# Altium schematic sheet C51_led.SchDoc
size A3
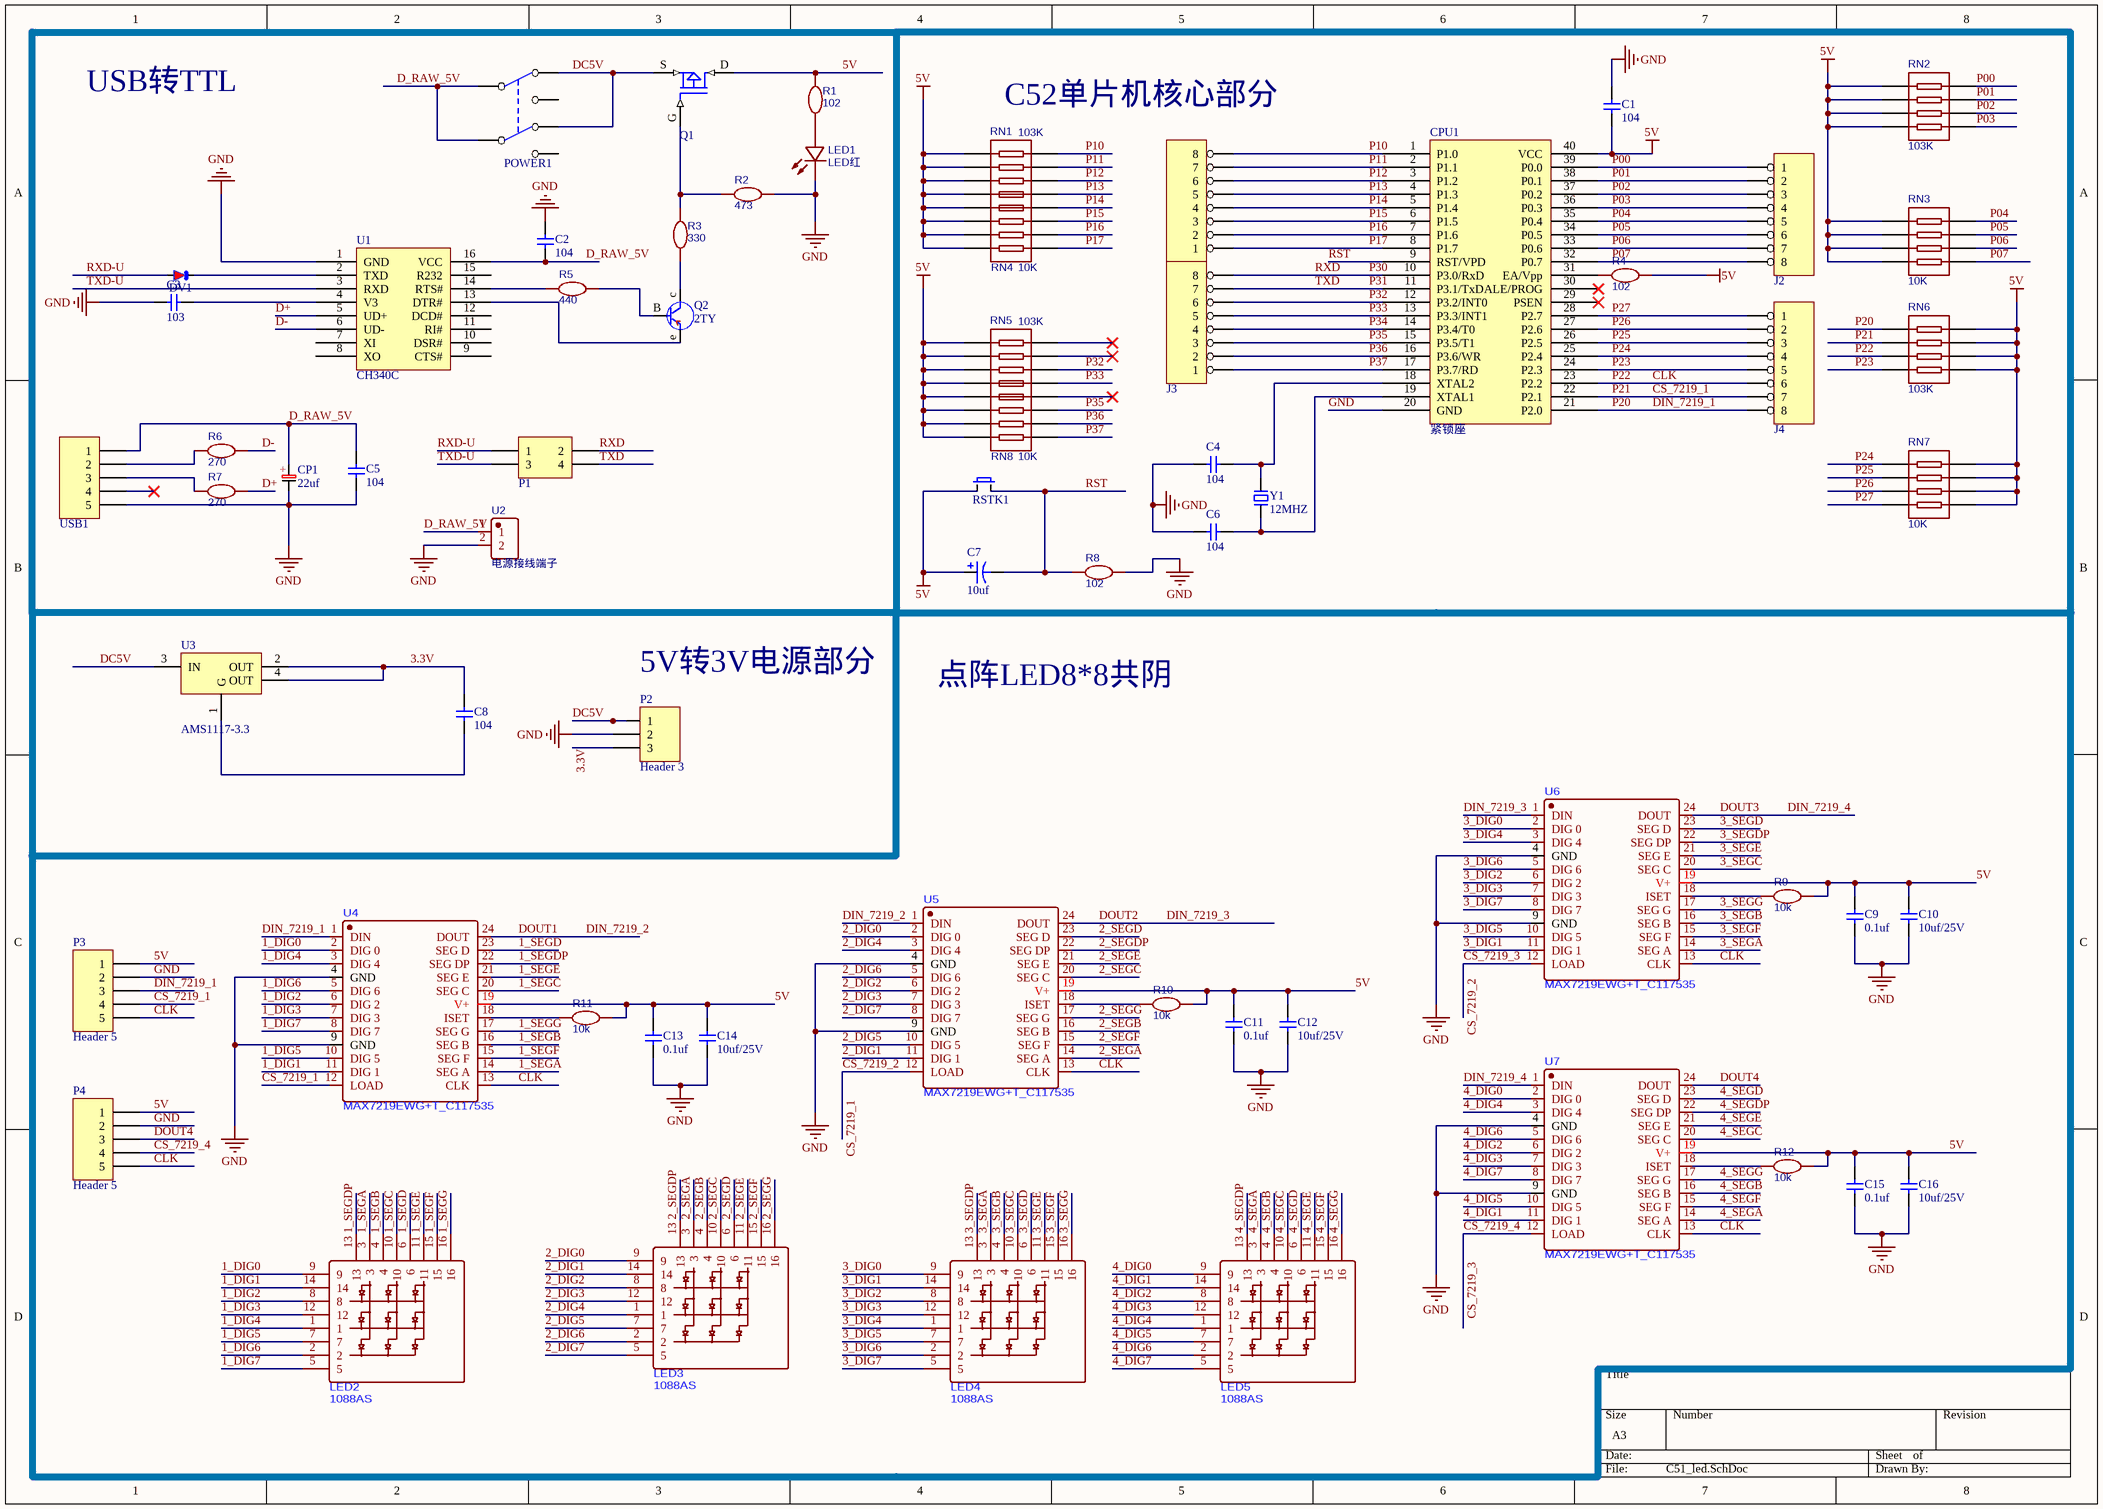
[diagram p0: C51_led.SchDoc]

## Parts
C1  104  [C1206]
C2  104  [C1206]
C3  103  [C1206]
C4  104  [C1206]
C5  104  [C1206]
C6  104  [C1206]
C7  10uf  [CD4]
C8  104  [C1206]
C9  0.1uf  [C1206]
C10  10uf/25V  [C1206]
C11  0.1uf  [C1206]
C12  10uf/25V  [C1206]
C13  0.1uf  [C1206]
C14  10uf/25V  [C1206]
C15  0.1uf  [C1206]
C16  10uf/25V  [C1206]
CP1  22uf  [CD4]
CPU1  紧锁座  [ZIF40 - D]
DV1  IN4148  [D1808A]  (value not drawn)
J1  SIP8  [SIP8]  (value not drawn)
J2  SIP8  [SIP8]  (value not drawn)
J3  SIP8  [SIP8]  (value not drawn)
J4  SIP8  [SIP8]  (value not drawn)
LED1  LED红  [LED1206-R-RD]
LED2  1088AS  [1088AS]
LED3  1088AS  [1088AS]
LED4  1088AS  [1088AS]
LED5  1088AS  [1088AS]
P1  Header 2X2  [HDR2X2]  (value not drawn)
P2  Header 3  [HDR1X3]
P3  Header 5  [HDR1X5]
P4  Header 5  [HDR1X5]
POWER1  自锁开关  [SW6]  (value not drawn)
Q1  MOS-P  [MOS-P]  (value not drawn)
Q2  2TY  [NPN-2TY]
R1  102  [R1206]
R2  473  [R1206]
R3  330  [R1206]
R4  102  [R1206]
R5  440  [R1206]
R6  270  [R1206]
R7  270  [R1206]
R8  102  [R1206]
R9  10k  [R1206]
R10  10k  [R1206]
R11  10k  [R1206]
R12  10k  [R1206]
RN1  103K  [RES-ARRAY-SMD_0603-8P-L3.2-W1.6-BL]
RN2  103K  [RES-ARRAY-SMD_0603-8P-L3.2-W1.6-BL]
RN3  10K  [RES-ARRAY-SMD_0603-8P-L3.2-W1.6-BL]
RN4  10K  [RES-ARRAY-SMD_0603-8P-L3.2-W1.6-BL]
RN5  103K  [RES-ARRAY-SMD_0603-8P-L3.2-W1.6-BL]
RN6  103K  [RES-ARRAY-SMD_0603-8P-L3.2-W1.6-BL]
RN7  10K  [RES-ARRAY-SMD_0603-8P-L3.2-W1.6-BL]
RN8  10K  [RES-ARRAY-SMD_0603-8P-L3.2-W1.6-BL]
RSTK1  按键  [JZ-SW2]  (value not drawn)
U1  CH340C  [SOP-16]
U2  电源接线端子  [2p_power]
U3  AMS1117-3.3  [SOT261]
U4  MAX7219EWG+T_C117535  [sop-24]
U5  MAX7219EWG+T_C117535  [sop-24]
U6  MAX7219EWG+T_C117535  [sop-24]
U7  MAX7219EWG+T_C117535  [sop-24]
USB1  MiniUSB  [MINIUSB_5PIN_4Pad_New]  (value not drawn)
Y1  12MHZ  [CC0.254]

## Blocks framed on the sheet
USB转TTL: C2 C3 C5 CP1 DV1 LED1 P1 POWER1 Q1 Q2 R1-R3 R5-R7 U1 U2 USB1

## Nets
5V: C1.1 C7.1 C9.2 C10.2 C11.2 C12.2 C13.2 C14.2 C15.2 C16.2 CPU1.40(VCC) P3.1 P4.1 Q1.D R1.1 R4.2 R9.1 R10.1 R11.1 R12.1 RN1.1 RN1.2 RN1.3 RN1.4 RN2.5 RN2.6 RN2.7 RN2.8 RN3.5 RN3.6 RN3.7 RN3.8 RN4.1 RN4.2 RN4.3 RN4.4 RN5.1 RN5.2 RN5.3 RN5.4 RN6.1 RN6.2 RN6.3 RN6.4 RN7.1 RN7.2 RN7.3 RN7.4 RN8.1 RN8.2 RN8.3 RN8.4 RSTK1.1 U4.19(V+) U5.19(V+) U6.19(V+) U7.19(V+)
GND: C1.2 C2.1 C3.1 C4.2 C5.1 C6.2 C9.1 C10.1 C11.1 C12.1 C13.1 C14.1 C15.1 C16.1 CP1.2 CPU1.20(GND) LED1.2(K) P2.2 P3.2 P4.2 R2.2 R8.2 U1.1(GND) U2.2 U4.4(GND) U4.9(GND) U5.4(GND) U5.9(GND) U6.4(GND) U6.9(GND) U7.4(GND) U7.9(GND) USB1.5
1_DIG0: LED2.9 U4.2(DIG_0)
1_DIG1: LED2.14 U4.11(DIG_1)
1_DIG2: LED2.8 U4.6(DIG_2)
1_DIG3: LED2.12 U4.7(DIG_3)
1_DIG4: LED2.1 U4.3(DIG_4)
1_DIG5: LED2.7 U4.10(DIG_5)
1_DIG6: LED2.2 U4.5(DIG_6)
1_DIG7: LED2.5 U4.8(DIG_7)
1_SEGA: LED2.3 U4.14(SEG_A)
1_SEGB: LED2.4 U4.16(SEG_B)
1_SEGC: LED2.10 U4.20(SEG_C)
1_SEGD: LED2.6 U4.23(SEG_D)
1_SEGDP: LED2.13 U4.22(SEG_DP)
1_SEGE: LED2.11 U4.21(SEG_E)
1_SEGF: LED2.15 U4.15(SEG_F)
1_SEGG: LED2.16 U4.17(SEG_G)
2_DIG0: LED3.9 U5.2(DIG_0)
2_DIG1: LED3.14 U5.11(DIG_1)
2_DIG2: LED3.8 U5.6(DIG_2)
2_DIG3: LED3.12 U5.7(DIG_3)
2_DIG4: LED3.1 U5.3(DIG_4)
2_DIG5: LED3.7 U5.10(DIG_5)
2_DIG6: LED3.2 U5.5(DIG_6)
2_DIG7: LED3.5 U5.8(DIG_7)
2_SEGA: LED3.3 U5.14(SEG_A)
2_SEGB: LED3.4 U5.16(SEG_B)
2_SEGC: LED3.10 U5.20(SEG_C)
2_SEGD: LED3.6 U5.23(SEG_D)
2_SEGDP: LED3.13 U5.22(SEG_DP)
2_SEGE: LED3.11 U5.21(SEG_E)
2_SEGF: LED3.15 U5.15(SEG_F)
2_SEGG: LED3.16 U5.17(SEG_G)
3.3V: C8.2 P2.3 U3.2(OUT) U3.4(OUT)
3_DIG0: LED4.9 U6.2(DIG_0)
3_DIG1: LED4.14 U6.11(DIG_1)
3_DIG2: LED4.8 U6.6(DIG_2)
3_DIG3: LED4.12 U6.7(DIG_3)
3_DIG4: LED4.1 U6.3(DIG_4)
3_DIG5: LED4.7 U6.10(DIG_5)
3_DIG6: LED4.2 U6.5(DIG_6)
3_DIG7: LED4.5 U6.8(DIG_7)
3_SEGA: LED4.3 U6.14(SEG_A)
3_SEGB: LED4.4 U6.16(SEG_B)
3_SEGC: LED4.10 U6.20(SEG_C)
3_SEGD: LED4.6 U6.23(SEG_D)
3_SEGDP: LED4.13 U6.22(SEG_DP)
3_SEGE: LED4.11 U6.21(SEG_E)
3_SEGF: LED4.15 U6.15(SEG_F)
3_SEGG: LED4.16 U6.17(SEG_G)
4_DIG0: LED5.9 U7.2(DIG_0)
4_DIG1: LED5.14 U7.11(DIG_1)
4_DIG2: LED5.8 U7.6(DIG_2)
4_DIG3: LED5.12 U7.7(DIG_3)
4_DIG4: LED5.1 U7.3(DIG_4)
4_DIG5: LED5.7 U7.10(DIG_5)
4_DIG6: LED5.2 U7.5(DIG_6)
4_DIG7: LED5.5 U7.8(DIG_7)
4_SEGA: LED5.3 U7.14(SEG_A)
4_SEGB: LED5.4 U7.16(SEG_B)
4_SEGC: LED5.10 U7.20(SEG_C)
4_SEGD: LED5.6 U7.23(SEG_D)
4_SEGDP: LED5.13 U7.22(SEG_DP)
4_SEGE: LED5.11 U7.21(SEG_E)
4_SEGF: LED5.15 U7.15(SEG_F)
4_SEGG: LED5.16 U7.17(SEG_G)
CLK: CPU1.23(P2.2) J4.6 P3.5 P4.5 RN6.6 U4.13(CLK) U5.13(CLK) U6.13(CLK) U7.13(CLK)  [also labelled P22]
CS_7219_1: CPU1.22(P2.1) J4.7 P3.4 P4.4 RN6.7 U4.12(LOAD) U5.12(LOAD) U6.12(LOAD) U7.12(LOAD)  [also labelled CS_7219_2, CS_7219_3, CS_7219_4, P21]
D+: R7.2 U1.5(UD+)
D-: R6.2 U1.6(UD-)
D_RAW_5V: C2.2 C5.2 CP1.1 POWER1.2(COMMON1) POWER1.5(COMMON2) U1.16(VCC) U2.1 USB1.1
DC5V: P2.1 POWER1.1(NC1) POWER1.6(NC2) Q1.S U3.3(IN)
DIN_7219_1: CPU1.21(P2.0) J4.8 P3.3 RN6.8 U4.1(DIN)  [also labelled P20]
DIN_7219_2: U4.24(DOUT) U5.1(DIN)  [also labelled DOUT1]
DIN_7219_3: U5.24(DOUT) U6.1(DIN)  [also labelled DOUT2]
DIN_7219_4: U6.24(DOUT) U7.1(DIN)  [also labelled DOUT3]
DOUT4: P4.3 U7.24(DOUT)
P00: CPU1.39(P0.0) J2.1 RN2.1
P01: CPU1.38(P0.1) J2.2 RN2.2
P02: CPU1.37(P0.2) J2.3 RN2.3
P03: CPU1.36(P0.3) J2.4 RN2.4
P04: CPU1.35(P0.4) J2.5 RN3.1
P05: CPU1.34(P0.5) J2.6 RN3.2
P06: CPU1.33(P0.6) J2.7 RN3.3
P07: CPU1.32(P0.7) J2.8 RN3.4
P10: CPU1.1(P1.0) J1.8 RN1.8
P11: CPU1.2(P1.1) J1.7 RN1.7
P12: CPU1.3(P1.2) J1.6 RN1.6
P13: CPU1.4(P1.3) J1.5 RN1.5
P14: CPU1.5(P1.4) J1.4 RN4.8
P15: CPU1.6(P1.5) J1.3 RN4.7
P16: CPU1.7(P1.6) J1.2 RN4.6
P17: CPU1.8(P1.7) J1.1 RN4.5
P23: CPU1.24(P2.3) J4.5 RN6.5
P24: CPU1.25(P2.4) J4.4 RN7.8
P25: CPU1.26(P2.5) J4.3 RN7.7
P26: CPU1.27(P2.6) J4.2 RN7.6
P27: CPU1.28(P2.7) J4.1 RN7.5
P30: CPU1.10(P3.0/RxD) J3.8 P1.2  [also labelled RXD]
P31: CPU1.11(P3.1/TxD) J3.7 P1.4  [also labelled TXD]
P32: CPU1.12(P3.2/INT0) J3.6 RN5.6
P33: CPU1.13(P3.3/INT1) J3.5 RN5.5
P34: CPU1.14(P3.4/T0) J3.4
P35: CPU1.15(P3.5/T1) J3.3 RN8.7
P36: CPU1.16(P3.6/WR) J3.2 RN8.6
P37: CPU1.17(P3.7/RD) J3.1 RN8.5
RST: C7.2 CPU1.9(RST/VPD) R8.1 RSTK1.2
RXD-U: DV1.1 P1.1
TXD-U: P1.3 U1.3(RXD)
NetC3_2: C3.2 U1.4(V3)
NetC4_1: C4.1 CPU1.18(XTAL2) Y1.2
NetC6_1: C6.1 CPU1.19(XTAL1) Y1.1
NetC8_1: C8.1 U3.1(G)
NetCPU1_31: CPU1.31(EA/Vpp) R4.1
NetDV1_2: DV1.2 U1.2(TXD)
NetLED1_1: LED1.1(A) R1.2
NetQ1_G: Q1.G R2.1 R3.2
NetQ2_B: Q2.B(b) R5.1
NetQ2_c: Q2.c R3.1
NetQ2_e: Q2.e U1.13(DTR#)
NetR5_2: R5.2 U1.14(RTS#)
NetR6_1: R6.1 USB1.2
NetR7_1: R7.1 USB1.3
NetR9_2: R9.2 U6.18(ISET)
NetR10_2: R10.2 U5.18(ISET)
NetR11_2: R11.2 U4.18(ISET)
NetR12_2: R12.2 U7.18(ISET)

Not connected (* = marked no-connect by the designer): CPU1 29(PSEN)* 30(ALE/PROG)*; POWER1 3(NO1) 4(NO2); RN5 7* 8*; RN8 8*; U1 7(XI) 8(XO) 9(CTS#) 10(DSR#) 11(RI#) 12(DCD#) 15(R232); USB1 4*

## Notes on the sheet
- C52单片机核心部分
- (near P2) 5V转3V电源部分
- 点阵LED8*8共阴
- (in symbol CD) +

## Library data of the parts
C1-C6 C8-C16 = CAP
C7 = Cap Pol1: Polarized Capacitor (Radial); Value: 插件10uF; Published: *; LatestRevisionDate: *; LatestRevisionNote: *; Publisher: *
CP1 = CD: value: 插件470uF
CPU1 = 89C51: U
DV1 = D: value: IN4148
J1-J4 = 8 HEADER: 8 Pin Header
LED1 = OSR51206C1E: BOM_Manufacturer: OptoSupply; Contributor: LCSC; BOM_Supplier: LCSC; BOM_Supplier Part: C268276; BOM_Manufacturer Part: OSR51206C1E; BOM_JLCPCB Part Class: Extended Part; spicePre: L; spiceSymbolName: OSR51206C1E
P1 = Header 2X2: Header, 2-Pin, Dual row; LatestRevisionDate: 17-Jul-2002; LatestRevisionNote: Re-released for DXP Platform.; Publisher: Altium Limited
P2 = Header 3: Header, 3-Pin; LatestRevisionDate: 17-Jul-2002; LatestRevisionNote: Re-released for DXP Platform.; Publisher: Altium Limited
P3 P4 USB1 = Header 5: Header, 5-Pin; LatestRevisionDate: 17-Jul-2002; LatestRevisionNote: Re-released for DXP Platform.; Publisher: Altium Limited
POWER1 = SW3-DP
Q2 = 8550: value: 8550-NPN
R1-R12 = AC1206FR-072ML: BOM_Manufacturer: YAGEO; Contributor: LCSC; BOM_Supplier: LCSC; BOM_Supplier Part: C125917; BOM_Manufacturer Part: AC1206FR-072ML; BOM_JLCPCB Part Class: Extended Part; spicePre: R; spiceSymbolName: AC1206FR-072ML
RN1-RN8 = 3K: BOM_Manufacturer: UniOhm; BOM_Manufacturer Part: 4D03WGJ0302T5E; nameAlias: Resistance (Ohms); BOM_Supplier: LCSC; BOM_Supplier Part: C25733; BOM_JLCPCB Part Class: Extended Part; spicePre: R; spiceSymbolName: 4D03WGJ0302T5E
RSTK1 = JZ-SW2
U1 = CH340G
U2 = DG127R-5.0-02P-14-00A(H): BOM_Manufacturer: DEGSON; Contributor: LCSC; BOM_Supplier: LCSC; BOM_Supplier Part: C581335; BOM_Manufacturer Part: DG127R-5.0-02P-14-00A(H); BOM_JLCPCB Part Class: Extended Part; spicePre: U; spiceSymbolName: DG127R-5.0-02P-14-00A(H)
U3 = LM1117: LINER REG
Y1 = JT: value: 32.768K